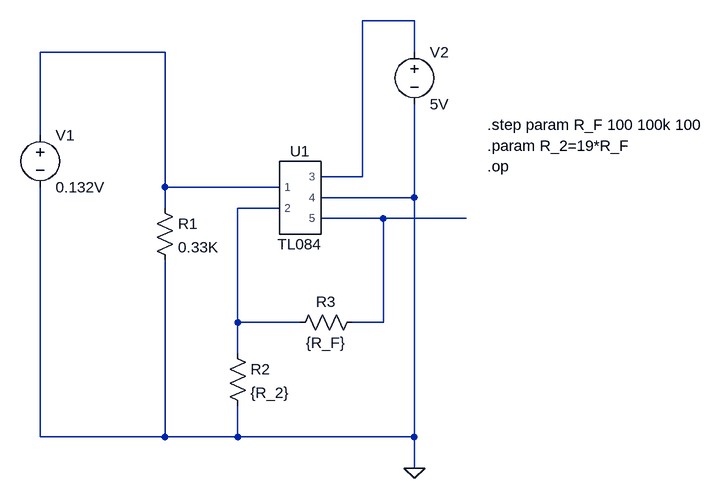
[diagram p0: schematic Draft1.asc]
Draft1.asc, the LTspice schematic file:
Version 4
SHEET 1 912 680
WIRE 368 -80 288 -80
WIRE -16 -32 -208 -32
WIRE 368 -32 368 -80
WIRE -208 96 -208 -32
WIRE 288 160 288 -80
WIRE 288 160 224 160
WIRE -16 176 -16 -32
WIRE 160 176 -16 176
WIRE 368 192 368 48
WIRE 368 192 224 192
WIRE -16 208 -16 176
WIRE 160 208 96 208
WIRE 320 224 224 224
WIRE 448 224 320 224
WIRE 96 384 96 208
WIRE 192 384 96 384
WIRE 320 384 320 224
WIRE 320 384 272 384
WIRE 96 432 96 384
WIRE -208 560 -208 176
WIRE -16 560 -16 288
WIRE -16 560 -208 560
WIRE 96 560 96 512
WIRE 96 560 -16 560
WIRE 368 560 368 192
WIRE 368 560 96 560
WIRE 368 608 368 560
FLAG 368 608 0
DATAFLAG 368 -80 ""
SYMBOL OpAmps\\TL084 192 192 R0
SYMATTR InstName U1
SYMBOL res -32 192 R0
SYMATTR InstName R1
SYMATTR Value 0.33K
SYMBOL res 80 416 R0
SYMATTR InstName R2
SYMATTR Value {R_2}
SYMBOL res 288 368 R90
WINDOW 0 0 56 VBottom 2
WINDOW 3 32 56 VTop 2
SYMATTR InstName R3
SYMATTR Value {R_F}
SYMBOL voltage -208 80 R0
SYMATTR InstName V1
SYMATTR Value 0.132V
SYMBOL voltage 368 -48 R0
SYMATTR InstName V2
SYMATTR Value 5V
TEXT 480 80 Left 2 !.step param R_F 100 100k 100
TEXT 480 112 Left 2 !.param R_2=19*R_F
TEXT 480 144 Left 2 !.op

The netlist it stands for:
* Draft1.asc
XU1 N002 N003 N001 0 N004 TL084  ; pins 1 2 3 4 5
R1 N002 0 0.33K
R2 N003 0 {R_2}
R3 N004 N003 {R_F}
V1 N002 0 0.132V
V2 N001 0 5V
.step param R_F 100 100k 100
.param R_2=19*R_F
.op
.lib C:\Users\KVentayen\OneDrive - California State University Chico\Desktop\Capstone\assets\TL084.cir
.backanno
.end

* Results of the author's LTspice run, read from the files saved beside the schematic
* From the log:
*   Semiconductor Device Operating Points:
*                           --- Diodes ---
*   Name:    d:u1:c      d:u1:e      d:u1:lp     d:u1:ln     d:u1:p
*   Model:    u1:dx       u1:dx       u1:dx       u1:dx       u1:dx
*   Id:     -1.26e-12    1.01e-04   -2.43e-11   -2.57e-11   -5.00e-12
*   Vd:     -1.26e+00    6.61e-01   -2.43e+01   -2.57e+01   -5.00e+00
*   Req:     1.00e+12    2.57e+02    1.00e+12    1.00e+12    1.00e+12
*   CAP:     0.00e+00    0.00e+00    0.00e+00    0.00e+00    0.00e+00
*                           --- JFET Transistors ---
*   Name:    j:u1:1      j:u1:2
*   Model:    u1:jx       u1:jx
*   Id:     -1.43e-06   -1.08e-04
*   Vgs:     9.27e-01   -4.03e-01
*   Vds:    -5.30e-01   -1.52e-01
*   Gm:      3.93e-05    8.19e-05
*   Gds:     0.00e+00    6.76e-04
*   Cgs:     0.00e+00    0.00e+00
*   Cgd:     0.00e+00    0.00e+00